# EAGLE design ATmega328p_Double_Sided_Example (EAGLE 8.6.1)
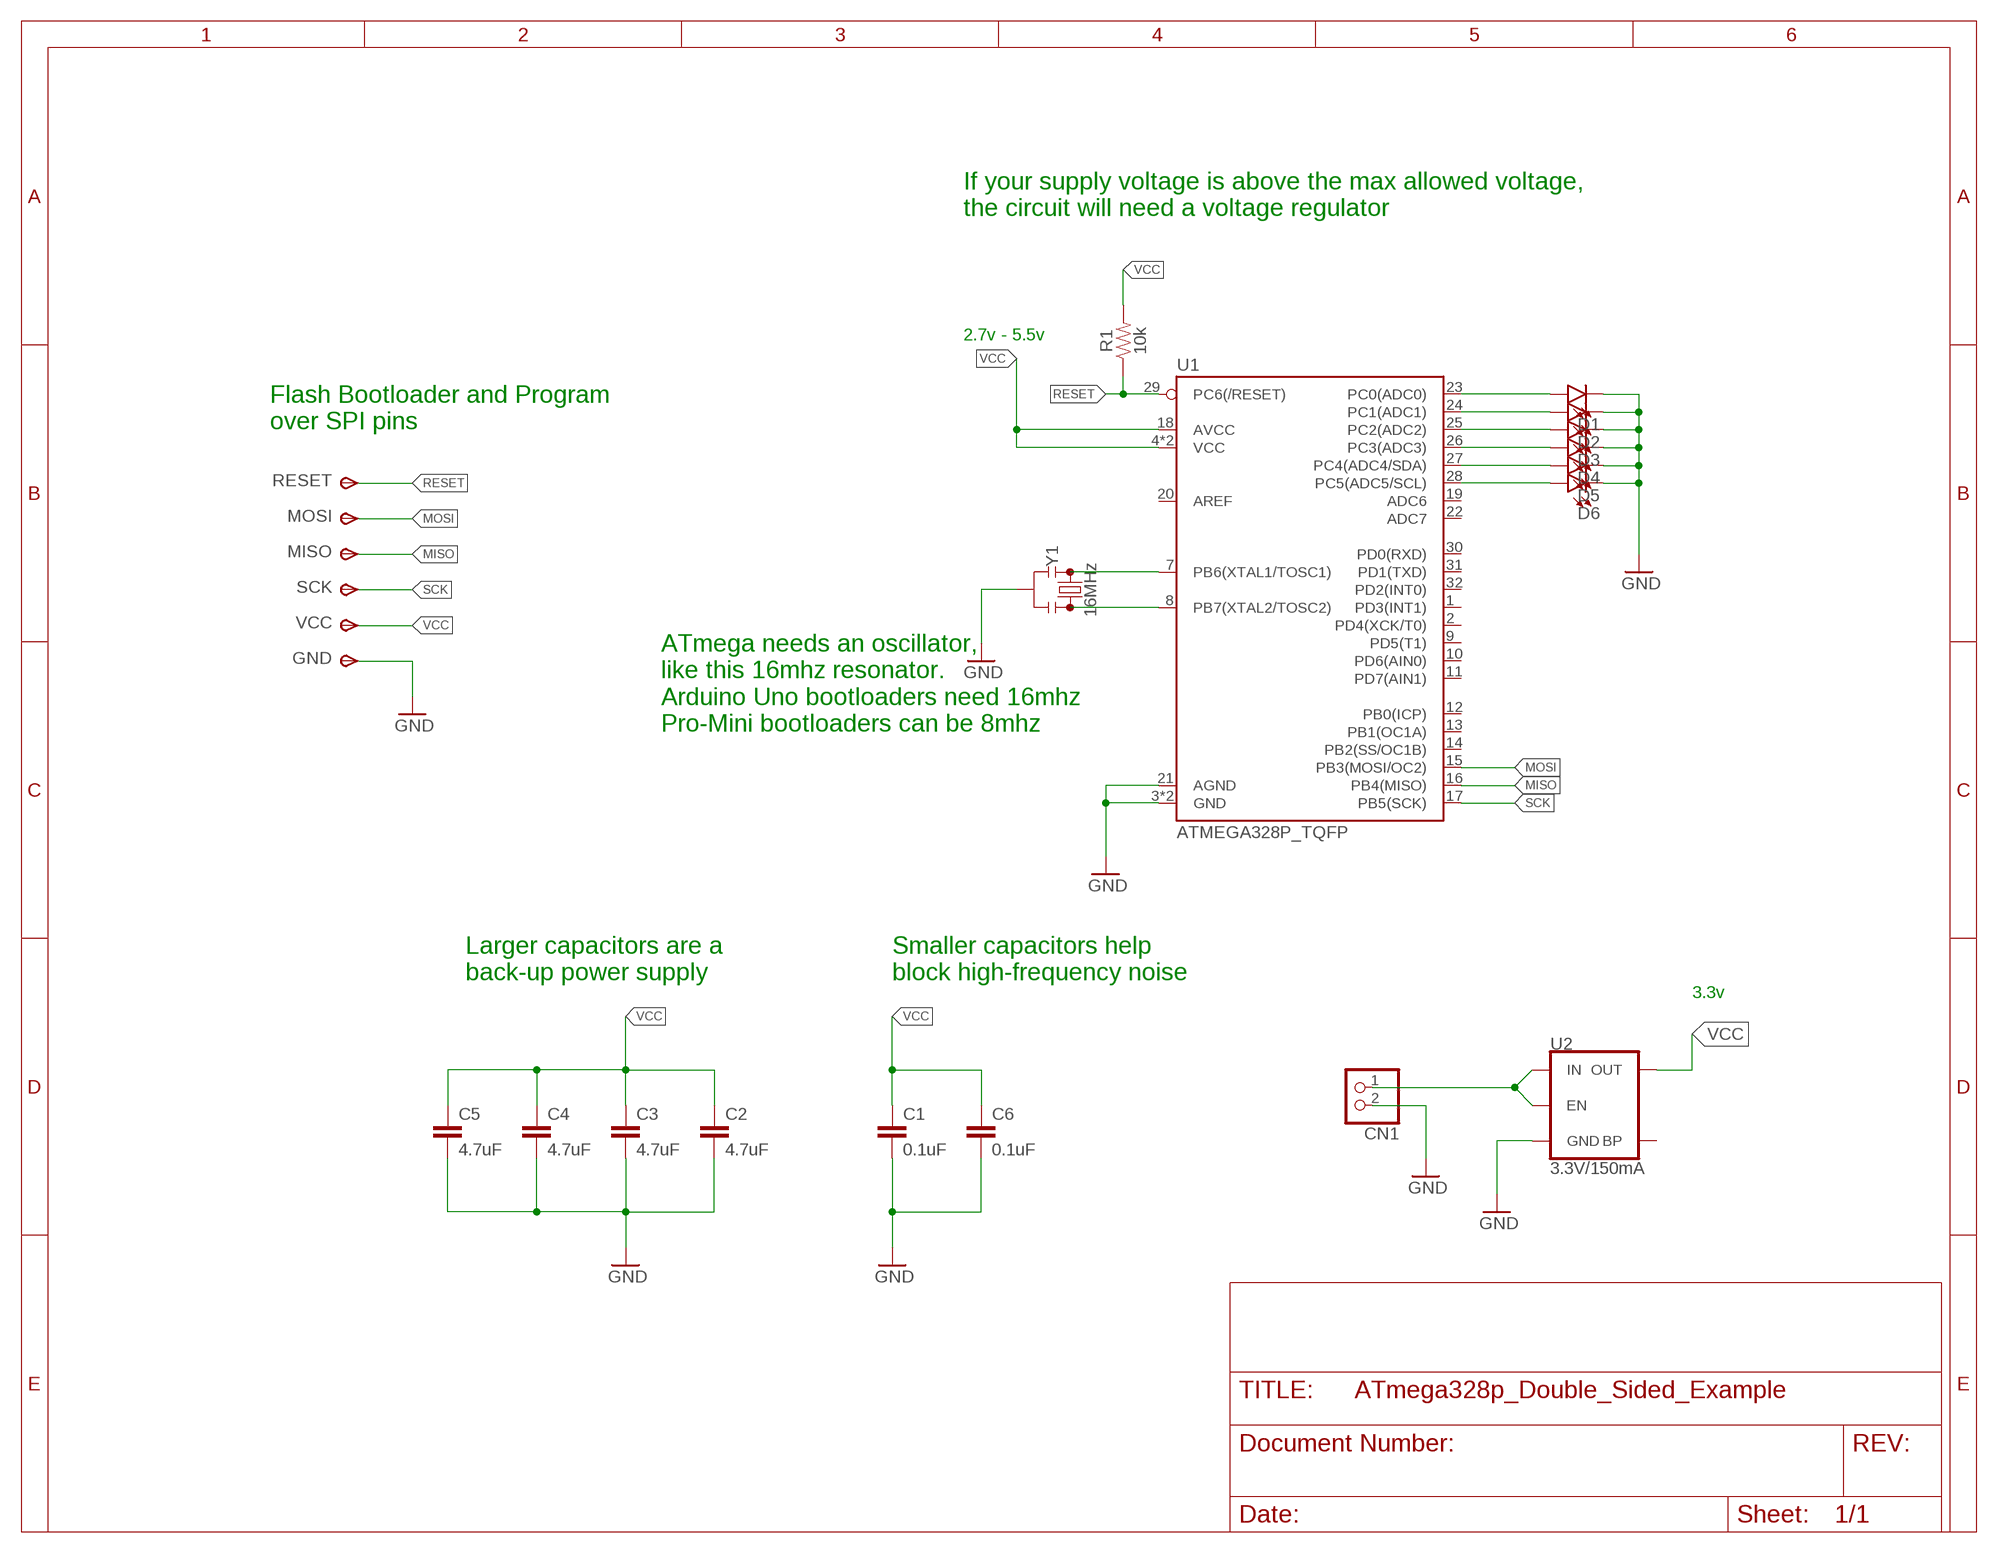
[diagram p0: schematic, sheet 1]

## Parts
C1  0.1uF  0.1UF-0603-25V-5%  [0603]
C2  4.7uF  4.7UF0603  [0603]
C3  4.7uF  4.7UF0603  [0603]
C4  4.7uF  4.7UF0603  [0603]
C5  4.7uF  4.7UF0603  [0603]
C6  0.1uF  0.1UF-0603-25V-5%  [0603]
CN1  JST_2PIN-SMT-RA  [JST-PH-2-SMT-RA]
D1  LED0603  [LED-0603]
D2  LED0603  [LED-0603]
D3  LED0603  [LED-0603]
D4  LED0603  [LED-0603]
D5  LED0603  [LED-0603]
D6  LED0603  [LED-0603]
GND  TPSTP14SQ  [TP14SQ]
MISO  TPSTP14SQ  [TP14SQ]
MOSI  TPSTP14SQ  [TP14SQ]
R1  10k  10KOHM-0603-1/10W-1%  [0603]
RESET  TPSTP14SQ  [TP14SQ]
SCK  TPSTP14SQ  [TP14SQ]
U1  ATMEGA328P_TQFP  [TQFP32-08]
U2  3.3V/150mA  V_REG_MIC52053.3V  [SOT23-5]
VCC  TPSTP14SQ  [TP14SQ]
Y1  16MHz  RESONATOR-16MHZSMD_3.2X1.3  [RESONATOR-SMD-3.2X1.3]

## Nets
GND: C1.2 C2.2 C3.2 C4.2 C5.2 C6.2 CN1.2 D1.C D2.C D3.C D4.C D5.C D6.C GND.TP(PP) U1.3(GND) U1.5(GND) U1.21(AGND) U2.2(GND) Y1.2
MISO: MISO.TP(PP) U1.16(PB4(MISO))
MOSI: MOSI.TP(PP) U1.15(PB3(MOSI/OC2))
N$1: CN1.1 U2.1(IN) U2.3(EN)
N$2: U1.7(PB6(XTAL1/TOSC1)) Y1.1
N$3: U1.8(PB7(XTAL2/TOSC2)) Y1.3
N$4: D1.A U1.23(PC0(ADC0))
N$5: D2.A U1.24(PC1(ADC1))
N$6: D3.A U1.25(PC2(ADC2))
N$7: D4.A U1.26(PC3(ADC3))
N$8: D5.A U1.27(PC4(ADC4/SDA))
N$9: D6.A U1.28(PC5(ADC5/SCL))
RESET: R1.1 RESET.TP(PP) U1.29(PC6(/RESET))
SCK: SCK.TP(PP) U1.17(PB5(SCK))
VCC: C1.1 C2.1 C3.1 C4.1 C5.1 C6.1 R1.2 U1.4(VCC) U1.6(VCC) U1.18(AVCC) U2.5(OUT) VCC.TP(PP)
Unconnected: U1.1(PD3(INT1)) U1.2(PD4(XCK/T0)) U1.9(PD5(T1)) U1.10(PD6(AIN0)) U1.11(PD7(AIN1)) U1.12(PB0(ICP)) U1.13(PB1(OC1A)) U1.14(PB2(SS/OC1B)) U1.19(ADC6) U1.20(AREF) U1.22(ADC7) U1.30(PD0(RXD)) U1.31(PD1(TXD)) U1.32(PD2(INT0)) U2.4(BP)

## Notes on the sheet
- If your supply voltage is above the max allowed voltage,
  the circuit will need a voltage regulator
- 2.7v - 5.5v
- Flash Bootloader and Program
  over SPI pins
- ATmega needs an oscillator,
  like this 16mhz resonator.
  Arduino Uno bootloaders need 16mhz
  Pro-Mini bootloaders can be 8mhz
- Larger capacitors are a
  back-up power supply
- Smaller capacitors help
  block high-frequency noise
- 3.3v

## Library data of the parts
C1 C6 = SparkFun-Capacitors:0.1UF: 0.1µF ceramic capacitors A capacitor is a passive two-terminal electrical component used to store electrical energy temporarily in an electric field.; PROD_ID: CAP-08604
C2-C5 = SparkFun-Capacitors:4.7UF: 4.7µF ceramic capacitors A capacitor is a passive two-terminal electrical component used to store electrical energy temporarily in an electric field.; PROD_ID: CAP-08280
CN1 = adafruit:JST_2PIN: JST 2-Pin Connectors of various flavors SMT-RA (S2B-PH-SM4) 4UConnector #17311 SMT (B2B-PH-SM4) THM-RA (S2B-PH) THM (B2B-PH)
D1-D6 = SparkFun-LED:LED: LED (Generic) Standard schematic elements and footprints for 5mm, 3mm, 1206, and 0603 sized LEDs. Generic LEDs with no color specified.
GND MISO MOSI RESET SCK VCC = testpad:TPS: TEST PIN
R1 = SparkFun-Resistors:10KOHM: 10kΩ resistor A resistor is a passive two-terminal electrical component that implements electrical resistance as a circuit element. Resistors act to reduce current flow, and, at the same time, act to lower voltage levels within circuits. - Wikipedia; PROD_ID: RES-00824
U1 = SparkFun-IC-Microcontroller:ATMEGA328P_TQFP: Popular 328P in QFP Storefront component: ATmega328 - TQFP <https://www.sparkfun.com/products/13448> (COM-13448) Datasheet <http://www.sparkfun.com/datasheets/Components/SMD/ATMega328.pdf> SparkFun Products SparkFun RedBoard - Programmed with Arduino <https://www.sparkfun.com/products/12757> (DEV-12757) Arduino Pro Mini 328 - 5V/16MHz <https://www.sparkfun.com/products/11113> (DEV-11113) Arduino Pro Mini 328 - 3.3V/8MHz <https://www.sparkfun.com/products/11114> (DEV-11114) SparkFun OpenLog <https://www.sparkfun.com/products/13712> (DEV-13712) SparkFun MicroView - OLED Arduino Module <https://www.sparkfun.com/products/12923> (DEV-12923) SparkFun Digital Sandbox <https://www.sparkfun.com/products/12651> (DEV-12651) SparkFun PicoBoard <https://www.sparkfun.com/products/11888> (WIG-11888) Arduino Fio <https://www.sparkfun.com/products/10116> (DEV-10116) LilyPad Arduino 328 Main Board <https://www.sparkfun.com/products/13342> (DEV-13342) SparkFun RedStick <https://www.sparkfun.com/products/13741> (DEV-13741) LilyPad MP3 <https://www.sparkfun.com/products/11013> (DEV-11013) LilyPad Arduino SimpleSnap <https://www.sparkfun.com/products/10941> (DEV-10941) SparkFun Stepoko <https://www.sparkfun.com/products/13899> (ROB-13899) SparkFun Geiger Counter <https://www.sparkfun.com/products/11345> (SEN-11345) SparkFun EL Sequencer <https://www.sparkfun.com/products/12781> (COM-12781) Arduino Pro 328 - 5V/16MHz <https://www.sparkfun.com/products/10915> (DEV-10915) CryptoCape <https://www.sparkfun.com/products/12773> (DEV-12773) SparkFun IR Thermometer Evaluation Board - MLX90614 <https://www.sparkfun.com/products/10740> (SEN-10740) SparkFun RedBot Mainboard <https://www.sparkfun.com/products/12097> (ROB-12097) Arduino Pro 328 - 3.3V/8MHz <https://www.sparkfun.com/products/10914> (DEV-10914) SparkFun Block for Intel® Edison - Arduino <https://www.sparkfun.com/products/13036> (DEV-13036) SparkFun Simon Says - Surface Mount Soldering Kit <https://www.sparkfun.com/products/10935> (KIT-10935) SparkFun 7-Segment Serial Display - Red <https://www.sparkfun.com/products/11441> (COM-11441) SparkFun 7-Segment Serial Display - White <https://www.sparkfun.com/products/11629> (COM-11629) SparkFun 7-Segment Serial Display - Yellow <https://www.sparkfun.com/products/11443> (COM-11443) SparkFun 7-Segment Serial Display - Kelly Green <https://www.sparkfun.com/products/11440> (COM-11440) SparkFun 7-Segment Serial Display - Blue <https://www.sparkfun.com/products/11442> (COM-11442) SparkFun OpenSegment Serial Display - 20mm (Blue) <https://www.sparkfun.com/products/11647> (COM-11647) SparkFun OpenSegment Serial Display - 20mm (Green) <https://www.sparkfun.com/products/11646> (COM-11646) SparkFun OpenSegment Serial Display - 20mm (White) <https://www.sparkfun.com/products/11648> (COM-11648) SparkFun OpenSegment Serial Display - 20mm (Red) <https://www.sparkfun.com/products/11644> (COM-11644) SparkFun OpenSegment Serial Display - 20mm (Yellow) <https://www.sparkfun.com/products/11645> (COM-11645) SparkFun OpenSegment Shield <https://www.sparkfun.com/products/13190> (DEV-13190); PROD_ID: IC-09069
U2 = SparkFun-IC-Power:V_REG_MIC5205: V_REG MIC5205 Standard 3.3V, 5V, and Adjustable 150mA LDO voltage regulator in SOT-23 layout. Micrel part MIC5205. BP (by-pass) pin is used to lower output noise with 470pF cap, may be left open. On the adjustable version BP is used to set output.; PROD_ID: VREG-00822
Y1 = SparkFun-Clocks:RESONATOR-16MHZ: 16MHz Resonator Digikey Example <http://www.digikey.com/product-detail/en/murata-electronics-north-america/CSTCE16M0V53-R0/490-1198-1-ND/584635> Frequency: 16MHz Frequency Stability: ±0.3% Frequency Tolerance: ±0.5% Capacitance: 15pF SparkFun Products SparkFun OpenLog <https://www.sparkfun.com/products/13712> SparkFun MicroView - OLED Arduino Module <https://www.sparkfun.com/products/12923>; PROD_ID: XTAL-08900

## Board
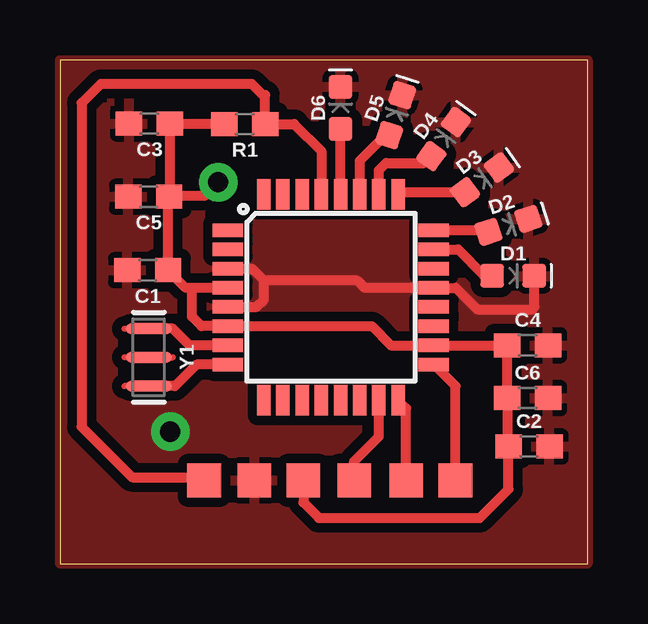
[diagram p1: board, top side]
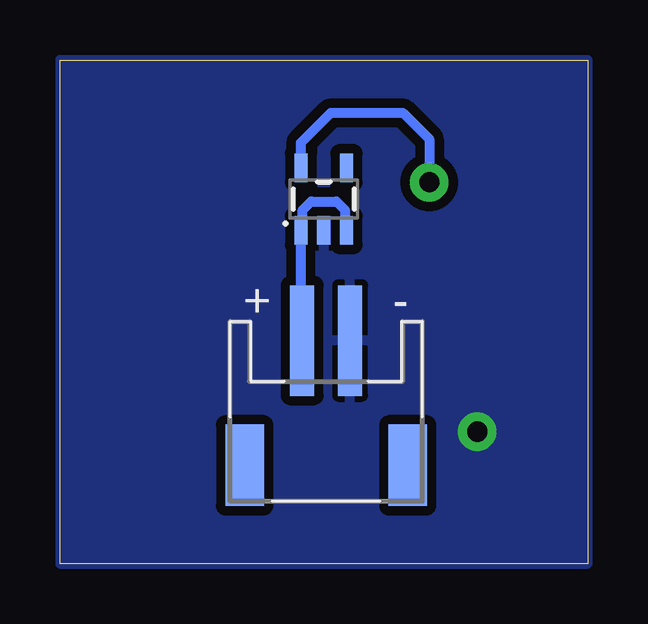
[diagram p2: board, bottom side, seen from below]

Size 22 x 21 mm. Coordinates in mm from the lower left corner, seen from the top.
Outline: 0,0 22,0 22,21 0,21 0,0
Copper layers (1*16): Top 0.035mm / dielectric 1.5mm / Bottom 0.035mm
Design rules "OthermillDRC_1_64_v2": minimum track width 16mil, minimum drill 31mil, track to track 0.39878125mm, track to pad 0.39878125mm, pad to pad 0.39878125mm, via to via 0.39878125mm, smd to smd 0mil, copper to edge 0mil, drill to drill 1mil, minimum pad ring 0mil, minimum via ring 15mil, stop-mask expansion 1mil, vias tented up to drill 30mil, thermal gap 10mil

### Footprints (pad centres in the part's own frame; a part is rotated, then mirrored left to right if it is on the bottom)
0603 = smd 1.1 x 1: 1 -0.85,0; 2 0.85,0
JST-PH-2-SMT-RA = smd 1 x 4.6: 1 1,-3.7; 2 -1,-3.7 | smd 1.6 x 3.4: NC1 -3.4,1.5; NC2 3.4,1.5
LED-0603 = smd 1 x 1: A -0.877,0; C 0.877,0
TP14SQ = smd 1.4 x 1.4: TP 0,0
TQFP32-08 = smd 1.27 x 0.559: 1 -4.293,2.8; 2 -4.293,2; 3 -4.293,1.2; 4 -4.293,0.4; 5 -4.293,-0.4; 6 -4.293,-1.2; 7 -4.293,-2; 8 -4.293,-2.8; 17 4.293,-2.8; 18 4.293,-2; 19 4.293,-1.2; 20 4.293,-0.4; 21 4.293,0.4; 22 4.293,1.2; 23 4.293,2; 24 4.293,2.8 | smd 0.559 x 1.27: 9 -2.8,-4.293; 10 -2,-4.293; 11 -1.2,-4.293; 12 -0.4,-4.293; 13 0.4,-4.293; 14 1.2,-4.293; 15 2,-4.293; 16 2.8,-4.293; 25 2.8,4.293; 26 2,4.293; 27 1.2,4.293; 28 0.4,4.293; 29 -0.4,4.293; 30 -1.2,4.293; 31 -2,4.293; 32 -2.8,4.293
SOT23-5 = smd 0.55 x 1.2: 1 -0.95,-1.3; 2 0,-1.3; 3 0.95,-1.3; 4 0.95,1.3; 5 -0.95,1.3
RESONATOR-SMD-3.2X1.3 = smd 0.45 x 1.905: 1 -1.2,0; 2 0,0; 3 1.2,0

### Placement (x,y rotation side)
C1  3.66,12.23 180 top
C2  19.56,4.88 0 top
C3  3.73,18.35 180 top
C4  19.5,9.1 0 top
C5  3.7,15.3 180 top
C6  19.5,6.9 0 top
CN1  10.9,5.6 180 bottom
D1  18.9,12 0 top
D2  18.7,14.1 18 top
D3  17.6,16 36 top
D4  16,17.7 54 top
D5  14,18.7 72 top
D6  11.7,19 90 top
GND  8.11,3.47 0 top
MISO  14.43,3.47 0 top
MOSI  12.27,3.47 0 top
R1  7.71,18.33 180 top
RESET  6.01,3.47 0 top
SCK  16.49,3.47 0 top
U1  11.3,11.1 0 top
U2  11,15.2 0 bottom
VCC  10.15,3.47 0 top
Y1  3.7,8.6 270 top

### Tracks (layer width: path | path; a pad name or v marks a point on that pad's centre or on a via)
GND  (via drill 0.84)
  Top 0.406: U1.5 8.2,10.7 8.5,11 8.5,11.8 | 8.5,11.8 8,12.3 U1.3 | D1.C 19.78,10.72 19.8,10.7 19.7,10.6 17.4,10.6 16.5,11.5 U1.21 12.7,11.5 12.4,11.8 8.5,11.8
  other vias: 4.6,5.5
  pour Top: 0,21 22,21 22,0 0,0
  pour Bottom: 0,21 22,21 22,0 0,0
MISO
  Top 0.406: MISO.TP 14.43,6.48 U1.16
MOSI
  Top 0.406: MOSI.TP 12.27,4.27 13.3,5.3 U1.15
N$1
  Bottom 0.406: CN1.1 11.95,9.35 U2.1 11.88,13.97 11.88,14.75 11.52,15.1 10.48,15.1 10.12,14.75 10.12,13.97 U2.3
N$2
  Top 0.406: U1.7 5.4,9.1 4.7,9.8 Y1.1
N$3
  Top 0.406: U1.8 5.7,8.3 4.8,7.4 Y1.3
N$4
  Top 0.406: D1.A 17.7,12 16.61,13.1 U1.23
N$5
  Top 0.406: U1.24 17.8,13.9 D2.A
N$6
  Top 0.406: U1.25 14.19,15.48 D3.A
N$7
  Top 0.406: U1.26 13.3,16.4 13.6,16.7 15.19,16.7 D4.A
N$8
  Top 0.406: U1.27 12.5,16.8 13.57,17.87 D5.A
N$9
  Top 0.406: U1.28 D6.A
RESET
  Top 0.406: U1.29 10.9,17.2 9.77,18.33 R1.1 8.56,19.54 8.46,19.54 8,20 1.7,20 0.9,19.2 0.9,5.7 3,3.6 5.88,3.6 RESET.TP
SCK
  Top 0.406: SCK.TP 16.49,7.4 U1.17
VCC  (via drill 0.84)
  Top 0.406: U1.4 5.5,11.5 | 5.5,11.5 5.24,11.5 C1.1 4.51,15.26 C5.1 4.58,15.33 | 5.5,11.5 5.5,10.3 5.9,9.9 U1.6 13,9.9 13.8,9.1 U1.18 C4.1 C6.1 18.65,4.94 C2.1 18.7,3.1 17.5,1.9 10.8,1.9 10.15,2.55 VCC.TP | R1.2 4.6,18.33 C3.1 4.58,15.33 | v6.6,15.9 6.03,15.33 4.58,15.33
  Bottom 0.406: U2.5 11.95,17.55 10.7,18.8 7.7,18.8 6.6,17.7 v6.6,15.9